# Altium schematic sheet ble.SchDoc
size A
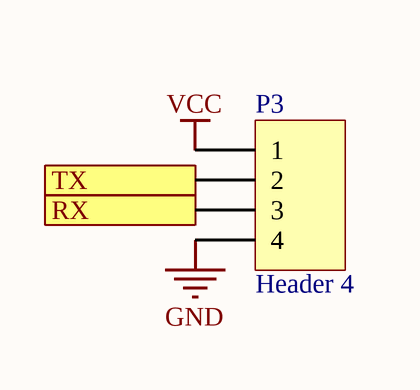
[diagram p0: ble.SchDoc]

## Parts
P3  Header 4  [HDR1X4]

## Ports
RX (in), TX (out)

## Nets
GND: P3.4
VCC: P3.1
RX: P3.3 ; port RX
TX: P3.2 ; port TX

## Library data of the parts
P3 = Header 4: Header, 4-Pin; LatestRevisionDate: 17-Jul-2002; LatestRevisionNote: Re-released for DXP Platform.; Publisher: Altium Limited